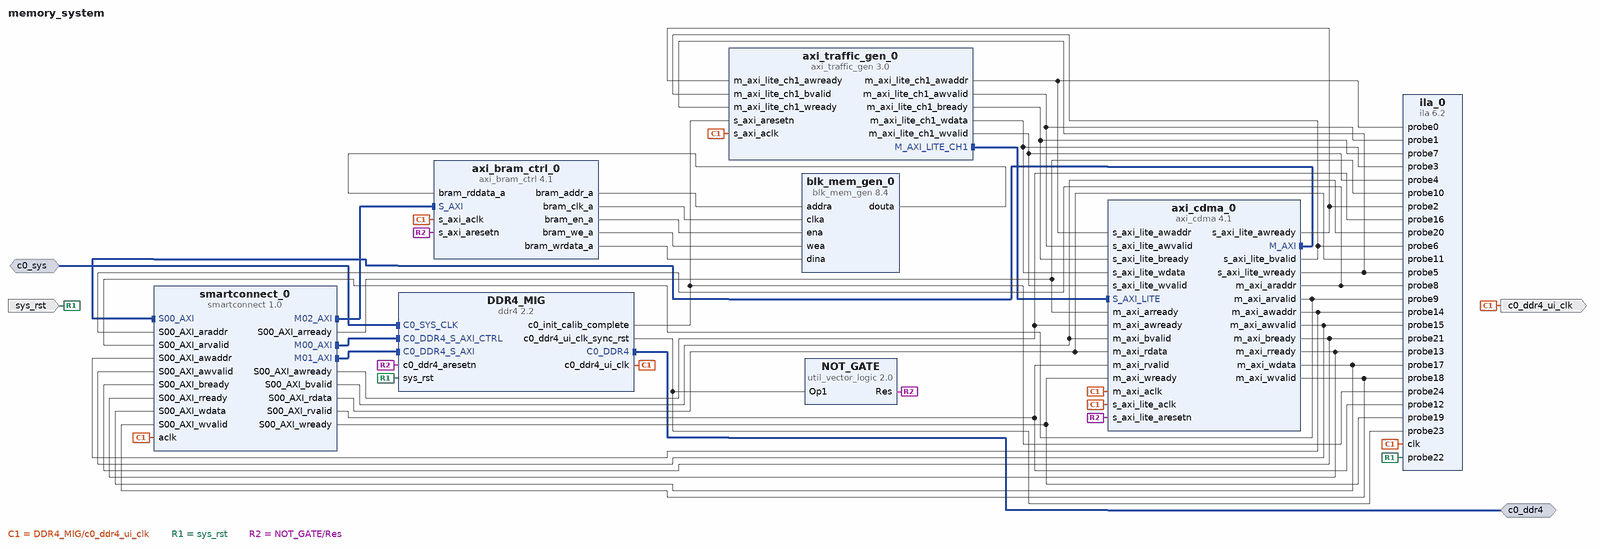
[diagram p0: block diagram of the top level]
# Vivado block design memory_system, xcu250-figd2104-2L-e, Vivado 2024.1
create_bd_design memory_system

create_bd_intf_port -mode Slave -vlnv xilinx.com:interface:diff_clock_rtl:1.0 c0_sys
set_property -dict {CONFIG.FREQ_HZ 300000000} [get_bd_intf_ports c0_sys]
create_bd_intf_port -mode Master -vlnv xilinx.com:interface:ddr4_rtl:1.0 c0_ddr4
create_bd_port -dir O -type clk c0_ddr4_ui_clk
create_bd_port -dir I -type rst sys_rst
set_property -dict {CONFIG.POLARITY ACTIVE_HIGH} [get_bd_ports sys_rst]

create_bd_cell -type ip -vlnv xilinx.com:ip:ddr4:2.2 DDR4_MIG
set_property -dict [list \
  CONFIG.ADDN_UI_CLKOUT1_FREQ_HZ 100 \
  CONFIG.C0.DDR4_AUTO_AP_COL_A3 true \
  CONFIG.C0.DDR4_Mem_Add_Map ROW_COLUMN_BANK_INTLV \
  CONFIG.C0_CLOCK_BOARD_INTERFACE default_300mhz_clk0 \
  CONFIG.C0_DDR4_BOARD_INTERFACE ddr4_sdram_c0 \
  CONFIG.RESET_BOARD_INTERFACE resetn \
] [get_bd_cells DDR4_MIG]
create_bd_cell -type ip -vlnv xilinx.com:ip:smartconnect:1.0 smartconnect_0
set_property -dict {CONFIG.HAS_ARESETN 0 CONFIG.NUM_MI 3 CONFIG.NUM_SI 1} [get_bd_cells smartconnect_0]
create_bd_cell -type ip -vlnv xilinx.com:ip:axi_traffic_gen:3.0 axi_traffic_gen_0
set_property -dict [list \
  CONFIG.ATG_OPTIONS Custom \
  CONFIG.C_ATG_MODE AXI4-Lite \
  CONFIG.C_ATG_SYSTEM_INIT_ADDR_MIF ../atg_addr.coe \
  CONFIG.C_ATG_SYSTEM_INIT_DATA_MIF ../atg_data.coe \
] [get_bd_cells axi_traffic_gen_0]
create_bd_cell -type ip -vlnv xilinx.com:ip:util_vector_logic:2.0 NOT_GATE
set_property -dict {CONFIG.C_OPERATION not CONFIG.C_SIZE 1} [get_bd_cells NOT_GATE]
create_bd_cell -type ip -vlnv xilinx.com:ip:axi_cdma:4.1 axi_cdma_0
set_property -dict [list \
  CONFIG.C_ADDR_WIDTH 34 \
  CONFIG.C_INCLUDE_SG 0 \
  CONFIG.C_M_AXI_DATA_WIDTH 512 \
  CONFIG.C_M_AXI_MAX_BURST_LEN 8 \
] [get_bd_cells axi_cdma_0]
create_bd_cell -type ip -vlnv xilinx.com:ip:ila:6.2 ila_0
set_property -dict [list \
  CONFIG.C_DATA_DEPTH 4096 \
  CONFIG.C_MONITOR_TYPE Native \
  CONFIG.C_NUM_OF_PROBES 25 \
  CONFIG.C_PROBE0_WIDTH 6 \
  CONFIG.C_PROBE11_WIDTH 64 \
  CONFIG.C_PROBE14_WIDTH 34 \
  CONFIG.C_PROBE17_WIDTH 64 \
  CONFIG.C_PROBE3_WIDTH 32 \
  CONFIG.C_PROBE8_WIDTH 34 \
] [get_bd_cells ila_0]
create_bd_cell -type ip -vlnv xilinx.com:ip:axi_bram_ctrl:4.1 axi_bram_ctrl_0
set_property -dict {CONFIG.DATA_WIDTH 512 CONFIG.SINGLE_PORT_BRAM 1} [get_bd_cells axi_bram_ctrl_0]
create_bd_cell -type ip -vlnv xilinx.com:ip:blk_mem_gen:8.4 blk_mem_gen_0
set_property -dict [list \
  CONFIG.Coe_File ../bram_init.coe \
  CONFIG.EN_SAFETY_CKT false \
  CONFIG.Enable_32bit_Address true \
  CONFIG.Fill_Remaining_Memory_Locations false \
  CONFIG.Load_Init_File true \
  CONFIG.Read_Width_A 512 \
  CONFIG.Register_PortA_Output_of_Memory_Primitives false \
  CONFIG.Use_RSTA_Pin true \
  CONFIG.Write_Depth_A 1024 \
  CONFIG.Write_Width_A 512 \
  CONFIG.use_bram_block Stand_Alone \
] [get_bd_cells blk_mem_gen_0]

# ---- connections ----

connect_bd_intf_net -intf_net C0_SYS_CLK_0_1 [get_bd_intf_ports c0_sys] [get_bd_intf_pins DDR4_MIG/C0_SYS_CLK]
connect_bd_intf_net [get_bd_intf_pins axi_cdma_0/M_AXI] [get_bd_intf_pins smartconnect_0/S00_AXI]
connect_bd_intf_net [get_bd_intf_pins axi_traffic_gen_0/M_AXI_LITE_CH1] [get_bd_intf_pins axi_cdma_0/S_AXI_LITE]
connect_bd_intf_net -intf_net ddr4_0_C0_DDR4 [get_bd_intf_ports c0_ddr4] [get_bd_intf_pins DDR4_MIG/C0_DDR4]
connect_bd_intf_net [get_bd_intf_pins smartconnect_0/M00_AXI] [get_bd_intf_pins DDR4_MIG/C0_DDR4_S_AXI_CTRL]
connect_bd_intf_net [get_bd_intf_pins smartconnect_0/M01_AXI] [get_bd_intf_pins DDR4_MIG/C0_DDR4_S_AXI]
connect_bd_intf_net [get_bd_intf_pins axi_bram_ctrl_0/S_AXI] [get_bd_intf_pins smartconnect_0/M02_AXI]
connect_bd_net -net CDMA_CONFIG_awaddr [get_bd_pins axi_traffic_gen_0/m_axi_lite_ch1_awaddr] \
  [get_bd_pins axi_cdma_0/s_axi_lite_awaddr] [get_bd_pins ila_0/probe0]
connect_bd_net -net CDMA_CONFIG_awready [get_bd_pins axi_cdma_0/s_axi_lite_awready] \
  [get_bd_pins axi_traffic_gen_0/m_axi_lite_ch1_awready] [get_bd_pins ila_0/probe2]
connect_bd_net -net CDMA_CONFIG_awvalid [get_bd_pins axi_traffic_gen_0/m_axi_lite_ch1_awvalid] \
  [get_bd_pins axi_cdma_0/s_axi_lite_awvalid] [get_bd_pins ila_0/probe1]
connect_bd_net -net CDMA_CONFIG_bready [get_bd_pins axi_traffic_gen_0/m_axi_lite_ch1_bready] \
  [get_bd_pins axi_cdma_0/s_axi_lite_bready] [get_bd_pins ila_0/probe7]
connect_bd_net -net CDMA_CONFIG_bvalid [get_bd_pins axi_cdma_0/s_axi_lite_bvalid] \
  [get_bd_pins axi_traffic_gen_0/m_axi_lite_ch1_bvalid] [get_bd_pins ila_0/probe6]
connect_bd_net -net CDMA_CONFIG_wdata [get_bd_pins axi_traffic_gen_0/m_axi_lite_ch1_wdata] \
  [get_bd_pins axi_cdma_0/s_axi_lite_wdata] [get_bd_pins ila_0/probe3]
connect_bd_net -net CDMA_CONFIG_wready [get_bd_pins axi_cdma_0/s_axi_lite_wready] \
  [get_bd_pins axi_traffic_gen_0/m_axi_lite_ch1_wready] [get_bd_pins ila_0/probe5]
connect_bd_net -net CDMA_CONFIG_wvalid [get_bd_pins axi_traffic_gen_0/m_axi_lite_ch1_wvalid] \
  [get_bd_pins axi_cdma_0/s_axi_lite_wvalid] [get_bd_pins ila_0/probe4]
connect_bd_net -net CDMA_DATA_araddr [get_bd_pins axi_cdma_0/m_axi_araddr] [get_bd_pins smartconnect_0/S00_AXI_araddr] [get_bd_pins ila_0/probe8]
connect_bd_net -net CDMA_DATA_arready [get_bd_pins smartconnect_0/S00_AXI_arready] [get_bd_pins axi_cdma_0/m_axi_arready] [get_bd_pins ila_0/probe10]
connect_bd_net -net CDMA_DATA_arvalid [get_bd_pins axi_cdma_0/m_axi_arvalid] [get_bd_pins smartconnect_0/S00_AXI_arvalid] [get_bd_pins ila_0/probe9]
connect_bd_net -net CDMA_DATA_awaddr [get_bd_pins axi_cdma_0/m_axi_awaddr] [get_bd_pins smartconnect_0/S00_AXI_awaddr] [get_bd_pins ila_0/probe14]
connect_bd_net -net CDMA_DATA_awready [get_bd_pins smartconnect_0/S00_AXI_awready] [get_bd_pins axi_cdma_0/m_axi_awready] [get_bd_pins ila_0/probe16]
connect_bd_net -net CDMA_DATA_awvalid [get_bd_pins axi_cdma_0/m_axi_awvalid] [get_bd_pins smartconnect_0/S00_AXI_awvalid] [get_bd_pins ila_0/probe15]
connect_bd_net -net CDMA_DATA_bready [get_bd_pins axi_cdma_0/m_axi_bready] [get_bd_pins smartconnect_0/S00_AXI_bready] [get_bd_pins ila_0/probe21]
connect_bd_net -net CDMA_DATA_bvalid [get_bd_pins smartconnect_0/S00_AXI_bvalid] [get_bd_pins axi_cdma_0/m_axi_bvalid] [get_bd_pins ila_0/probe20]
connect_bd_net -net CDMA_DATA_rdata [get_bd_pins smartconnect_0/S00_AXI_rdata] [get_bd_pins axi_cdma_0/m_axi_rdata] [get_bd_pins ila_0/probe11]
connect_bd_net -net CDMA_DATA_rready [get_bd_pins axi_cdma_0/m_axi_rready] [get_bd_pins smartconnect_0/S00_AXI_rready] [get_bd_pins ila_0/probe13]
connect_bd_net -net CDMA_DATA_rvalid [get_bd_pins smartconnect_0/S00_AXI_rvalid] [get_bd_pins axi_cdma_0/m_axi_rvalid] [get_bd_pins ila_0/probe12]
connect_bd_net -net CDMA_DATA_wdata [get_bd_pins axi_cdma_0/m_axi_wdata] [get_bd_pins smartconnect_0/S00_AXI_wdata] [get_bd_pins ila_0/probe17]
connect_bd_net -net CDMA_DATA_wready [get_bd_pins smartconnect_0/S00_AXI_wready] [get_bd_pins axi_cdma_0/m_axi_wready] [get_bd_pins ila_0/probe19]
connect_bd_net -net CDMA_DATA_wvalid [get_bd_pins axi_cdma_0/m_axi_wvalid] [get_bd_pins smartconnect_0/S00_AXI_wvalid] [get_bd_pins ila_0/probe18]
connect_bd_net [get_bd_pins DDR4_MIG/c0_ddr4_ui_clk] \
  [get_bd_ports c0_ddr4_ui_clk] [get_bd_pins smartconnect_0/aclk] [get_bd_pins axi_traffic_gen_0/s_axi_aclk] \
  [get_bd_pins axi_cdma_0/m_axi_aclk] [get_bd_pins axi_cdma_0/s_axi_lite_aclk] [get_bd_pins axi_bram_ctrl_0/s_axi_aclk] \
  [get_bd_pins ila_0/clk]
connect_bd_net -net DDR4_c0_ddr4_ui_clk_sync_rst [get_bd_pins DDR4_MIG/c0_ddr4_ui_clk_sync_rst] [get_bd_pins NOT_GATE/Op1] [get_bd_pins ila_0/probe23]
connect_bd_net -net DDR4_c0_init_calib_complete [get_bd_pins DDR4_MIG/c0_init_calib_complete] \
  [get_bd_pins axi_traffic_gen_0/s_axi_aresetn] [get_bd_pins ila_0/probe24]
connect_bd_net -net DDR4_sys_rst [get_bd_ports sys_rst] [get_bd_pins DDR4_MIG/sys_rst] [get_bd_pins ila_0/probe22]
connect_bd_net [get_bd_pins NOT_GATE/Res] \
  [get_bd_pins DDR4_MIG/c0_ddr4_aresetn] [get_bd_pins axi_cdma_0/s_axi_lite_aresetn] \
  [get_bd_pins axi_bram_ctrl_0/s_axi_aresetn]
connect_bd_net [get_bd_pins axi_bram_ctrl_0/bram_addr_a] [get_bd_pins blk_mem_gen_0/addra]
connect_bd_net [get_bd_pins axi_bram_ctrl_0/bram_clk_a] [get_bd_pins blk_mem_gen_0/clka]
connect_bd_net [get_bd_pins axi_bram_ctrl_0/bram_en_a] [get_bd_pins blk_mem_gen_0/ena]
connect_bd_net [get_bd_pins axi_bram_ctrl_0/bram_we_a] [get_bd_pins blk_mem_gen_0/wea]
connect_bd_net [get_bd_pins axi_bram_ctrl_0/bram_wrdata_a] [get_bd_pins blk_mem_gen_0/dina]
connect_bd_net [get_bd_pins blk_mem_gen_0/douta] [get_bd_pins axi_bram_ctrl_0/bram_rddata_a]

# ---- address map ----
assign_bd_address -offset 0x000000000 -range 128K -target_address_space [get_bd_addr_spaces axi_cdma_0/Data] [get_bd_addr_segs axi_bram_ctrl_0/S_AXI/Mem0]
assign_bd_address -offset 0x0F0000000 -range 64K -target_address_space [get_bd_addr_spaces axi_cdma_0/Data] [get_bd_addr_segs DDR4_MIG/C0_DDR4_MEMORY_MAP/C0_DDR4_ADDRESS_BLOCK]
exclude_bd_addr_seg -offset 0x000000000 -range 1 -target_address_space [get_bd_addr_spaces axi_cdma_0/Data] [get_bd_addr_segs DDR4_MIG/C0_DDR4_MEMORY_MAP_CTRL/C0_REG]
assign_bd_address -offset 0x00000000 -range 64K -target_address_space [get_bd_addr_spaces axi_traffic_gen_0/Reg1] [get_bd_addr_segs axi_cdma_0/S_AXI_LITE/Reg]

validate_bd_design
save_bd_design
